# EAGLE design Scoreboard Wifi Controller 20170514 (EAGLE 7.6.0)
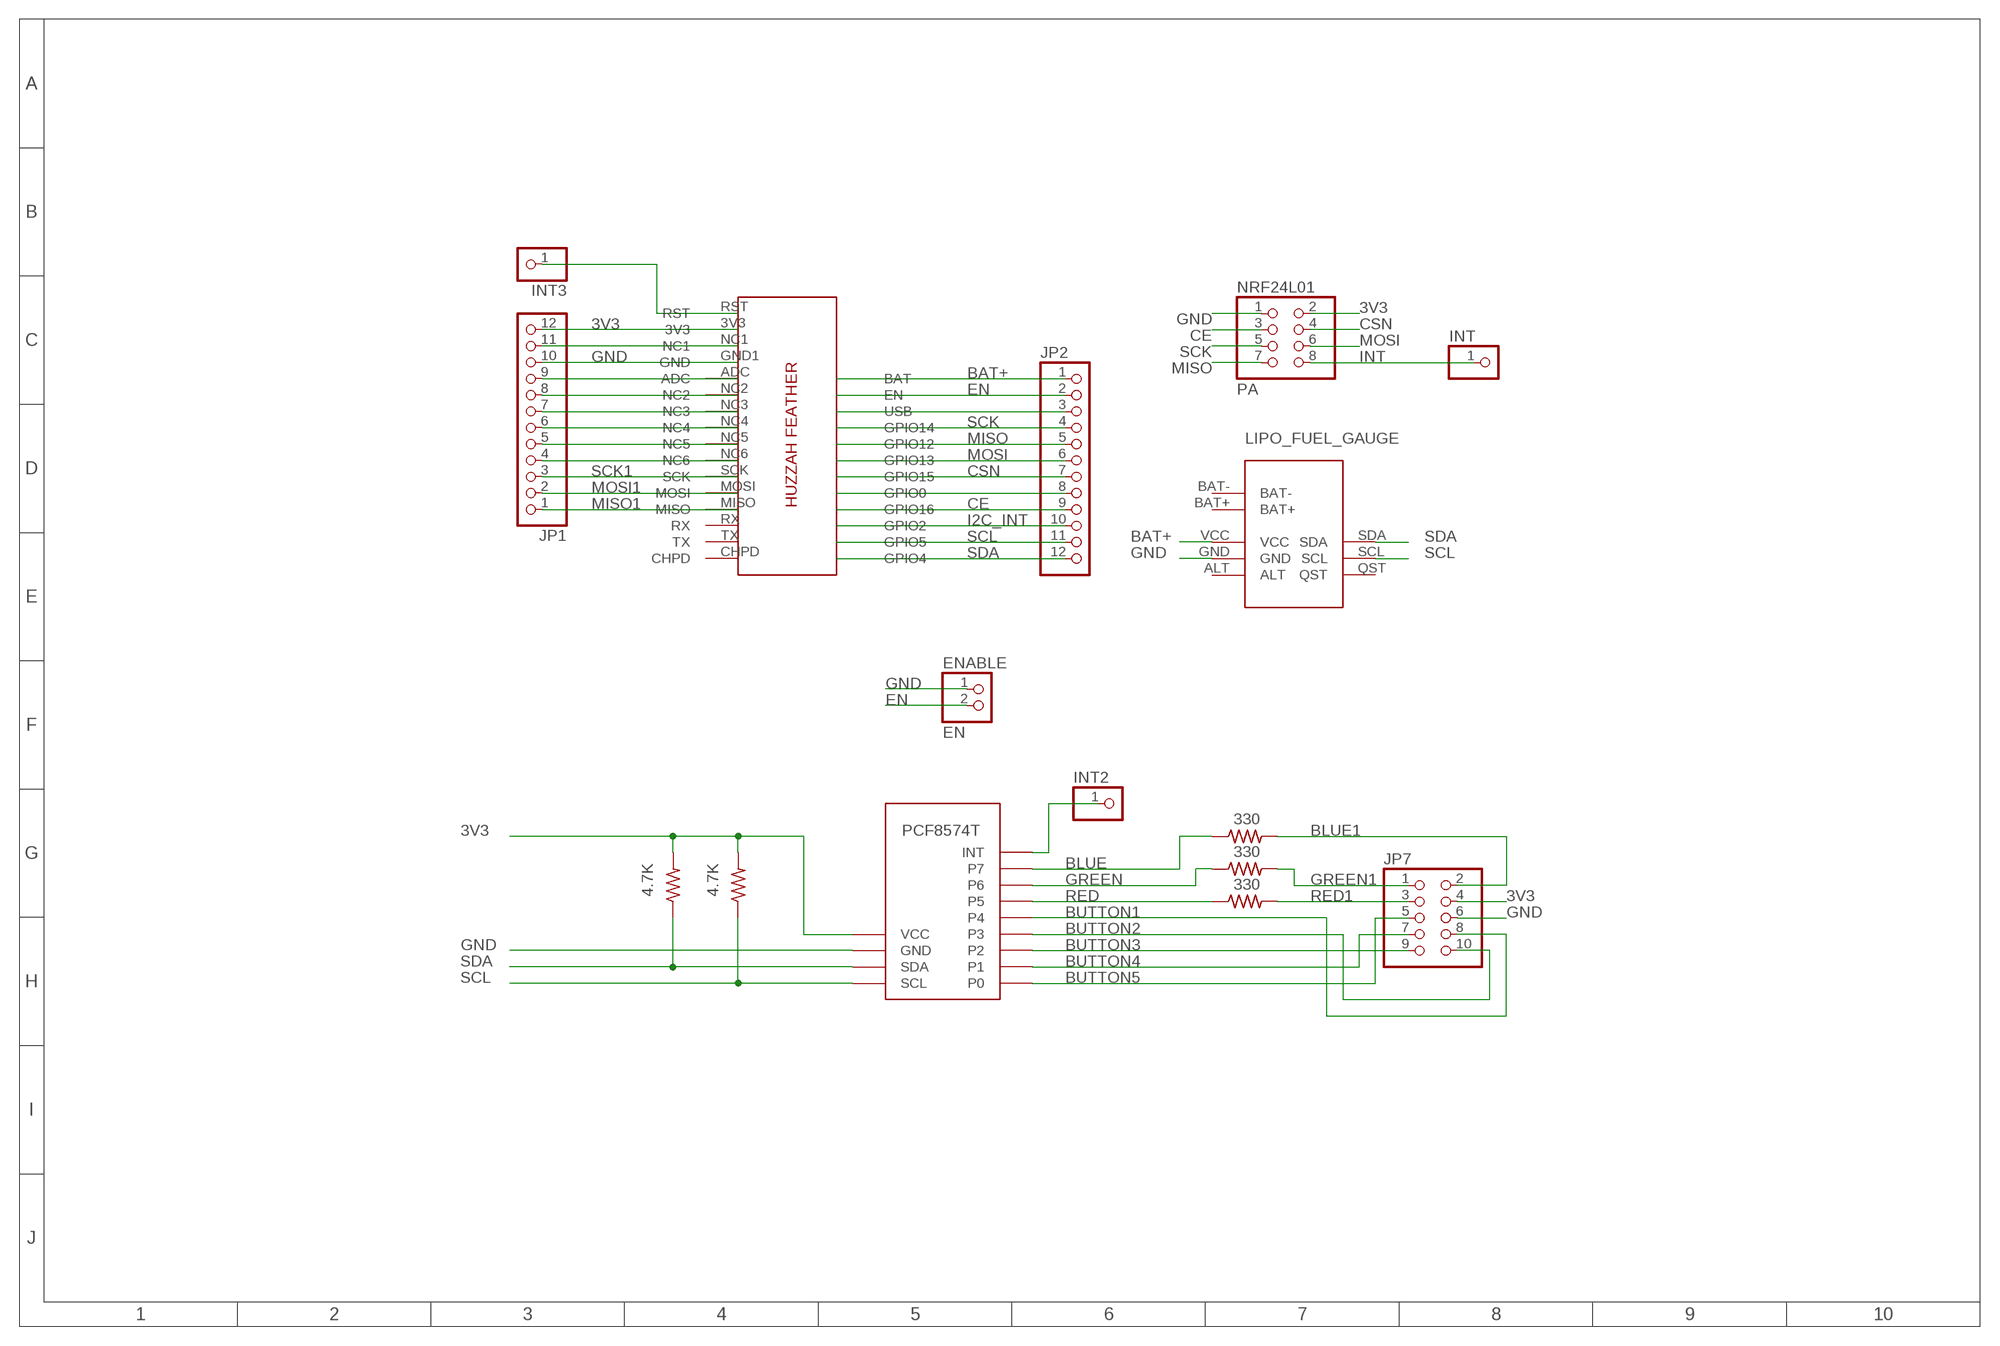
[diagram p0: schematic, sheet 1]

## Parts
ENABLE  EN  PINHD-1X2/90  [1X02/90]
INT  PINHD-1X1CB  [1X01-CLEANBIG]
INT2  PINHD-1X1CB  [1X01-CLEANBIG]
INT3  PINHD-1X1CB  [1X01-CLEANBIG]
JP1  PINHD-1X12-CB  [1X12-CB]
JP2  PINHD-1X12-CB  [1X12-CB]
JP7  PINHD-2X5/90  [2X05/90]
LIPO_FUEL_GAUGE  LIPO_FUEL_GAUGE  [LIPO_FUEL_GAUGE]
NRF24L01  PA  PINHD-2X4/90  [2X04/90]
R2  330  R-US_0207/10  [0207/10]
R3  330  R-US_0207/10  [0207/10]
R4  330  R-US_0207/10  [0207/10]
R5  4.7K  R-US_0207/10  [0207/10]
R6  4.7K  R-US_0207/10  [0207/10]
U$1  ADAFRUIT-FEATHER-ESP8266-HUZZAHALT  [ADAFRUIT-FEATHER-ESP8266-HUZZAH-ALT]
U$3  PCF8574T_IO_EXPANDER  [PCF8574T_IO_EXPANDER]

## Nets
3V3 [power]: JP1.12 JP7.4 NRF24L01.2 R5.2 R6.2 U$1.3V3 U$3.VCC
BAT+ [power]: JP2.1 LIPO_FUEL_GAUGE.VCC U$1.BAT
BLUE: R2.1 U$3.P$7(P7)
BLUE1: JP7.2 R2.2
BUTTON1: JP7.8 U$3.P$4(P4)
BUTTON2: JP7.10 U$3.P$3(P3)
BUTTON3: JP7.9 U$3.P$2(P2)
BUTTON4: JP7.7 U$3.P$1(P1)
BUTTON5: JP7.5 U$3.P$0(P0)
CE: JP2.9 NRF24L01.3 U$1.GPIO16
CSN: JP2.7 NRF24L01.4 U$1.GPIO15
EN: ENABLE.2 JP2.2 U$1.EN
GND [power]: ENABLE.1 JP1.10 JP7.6 LIPO_FUEL_GAUGE.GND NRF24L01.1 U$1.GND1(GND) U$3.GND
GREEN: R3.1 U$3.P$6(P6)
GREEN1: JP7.1 R3.2
I2C_INT: INT2.1 JP2.10 U$1.GPIO2 U$3.INT
INT: INT.1 NRF24L01.8
MISO: JP2.5 NRF24L01.7 U$1.GPIO12
MISO1: JP1.1 U$1.MISO
MOSI: JP2.6 NRF24L01.6 U$1.GPIO13
MOSI1: JP1.2 U$1.MOSI
N$39: JP1.9 U$1.ADC
N$63: JP2.8 U$1.GPIO0
N$64: JP2.3 U$1.USB
N$69: JP1.8 U$1.NC2
N$70: JP1.7 U$1.NC3
N$71: JP1.6 U$1.NC4
N$72: JP1.5 U$1.NC5
N$73: JP1.4 U$1.NC6
N$75: JP1.11 U$1.NC1
RED: R4.1 U$3.P$5(P5)
RED1: JP7.3 R4.2
RST: INT3.1 U$1.RST
SCK: JP2.4 NRF24L01.5 U$1.GPIO14
SCK1: JP1.3 U$1.SCK
SCL: JP2.11 LIPO_FUEL_GAUGE.SCL R5.1 U$1.GPIO5 U$3.SCL
SDA: JP2.12 LIPO_FUEL_GAUGE.SDA R6.1 U$1.GPIO4 U$3.SDA
Unconnected: LIPO_FUEL_GAUGE.ALT LIPO_FUEL_GAUGE.BAT+ LIPO_FUEL_GAUGE.BAT- LIPO_FUEL_GAUGE.QST U$1.CHPD U$1.RX U$1.TX

## Library data of the parts
ENABLE = pinhead:PINHD-1X2: PIN HEADER
INT INT2 INT3 = adafruit:PINHD-1X1: Pin header 1x1 for 0.1" spacing With round pins
JP1 JP2 = adafruit:PINHD-1X12: PIN HEADER
JP7 = pinhead:PINHD-2X5: PIN HEADER
LIPO_FUEL_GAUGE = Custom Parts:LIPO_FUEL_GAUGE
NRF24L01 = pinhead:PINHD-2X4: PIN HEADER
R2-R6 = adafruit:R-US_: RESISTOR, American symbol
U$1 = Custom Parts:ADAFRUIT-FEATHER-ESP8266-HUZZAH
U$3 = Custom Parts:PCF8574T_IO_EXPANDER

## Net classes
0 default: width 0.203 mm, clearance 0.203 mm
1 power: width 0.305 mm, clearance 0.203 mm
2 signal: width 0.203 mm, clearance 0.203 mm

## Board
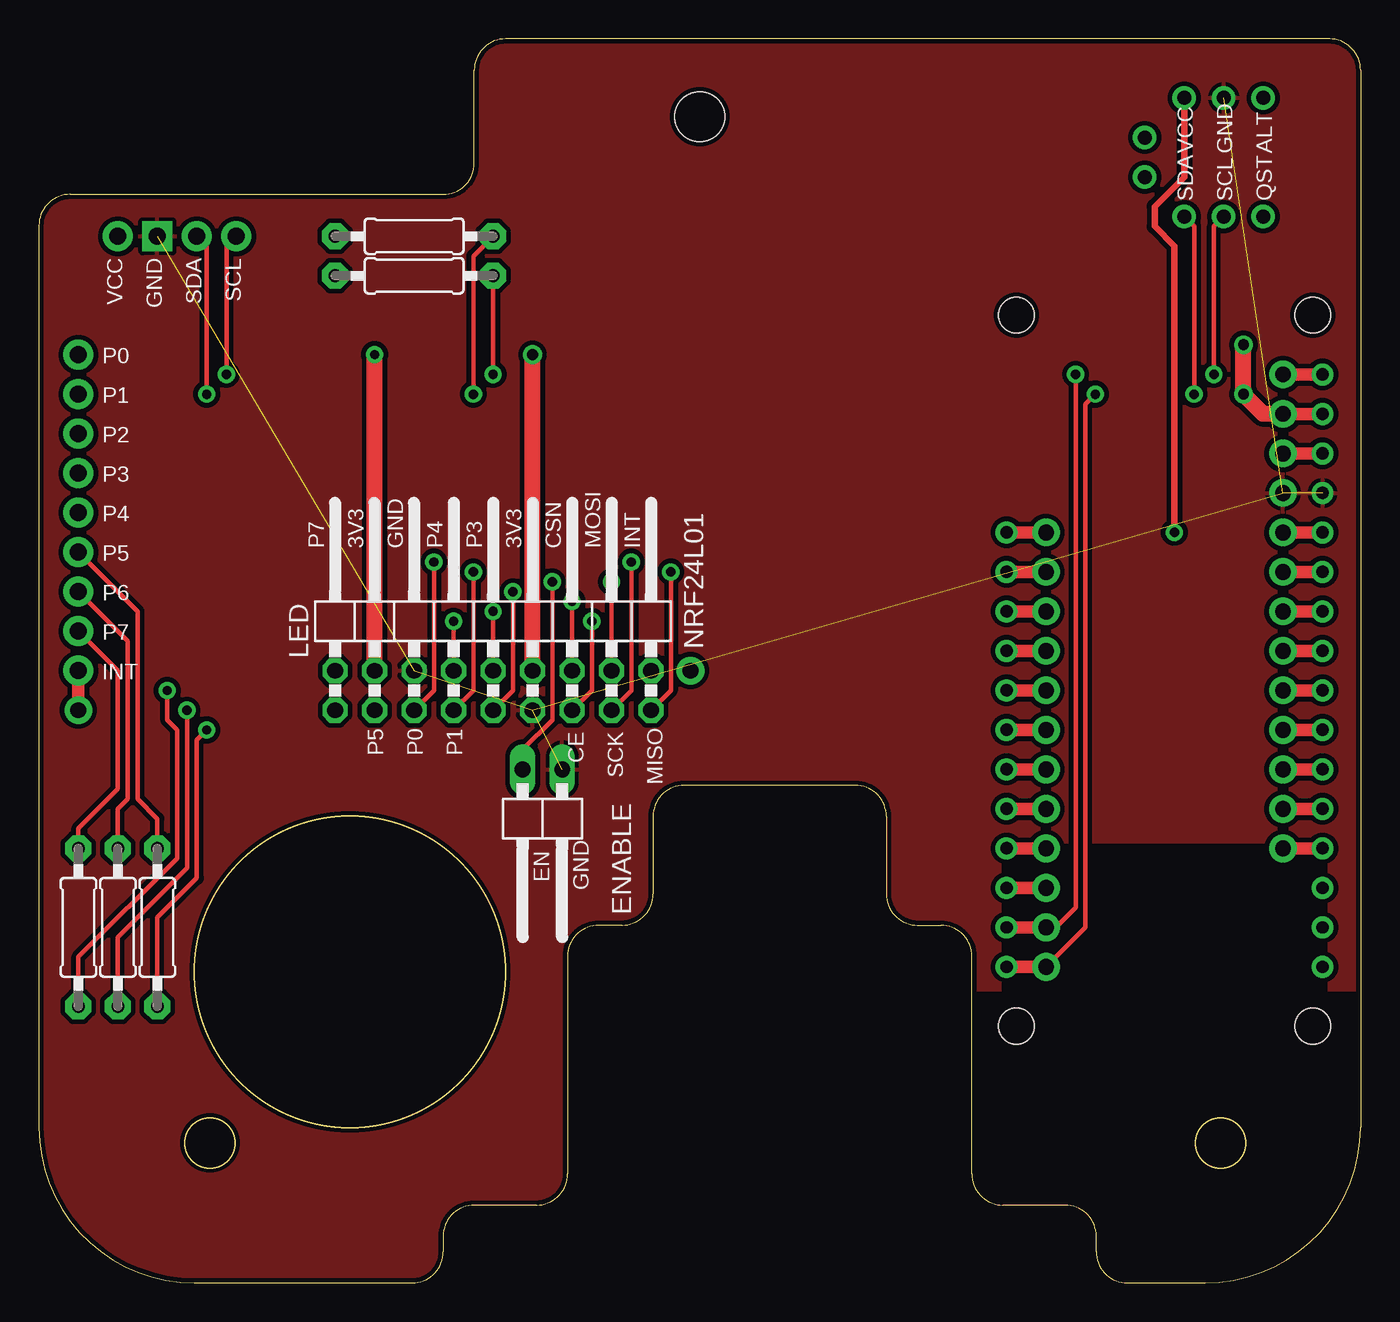
[diagram p1: board, top side]
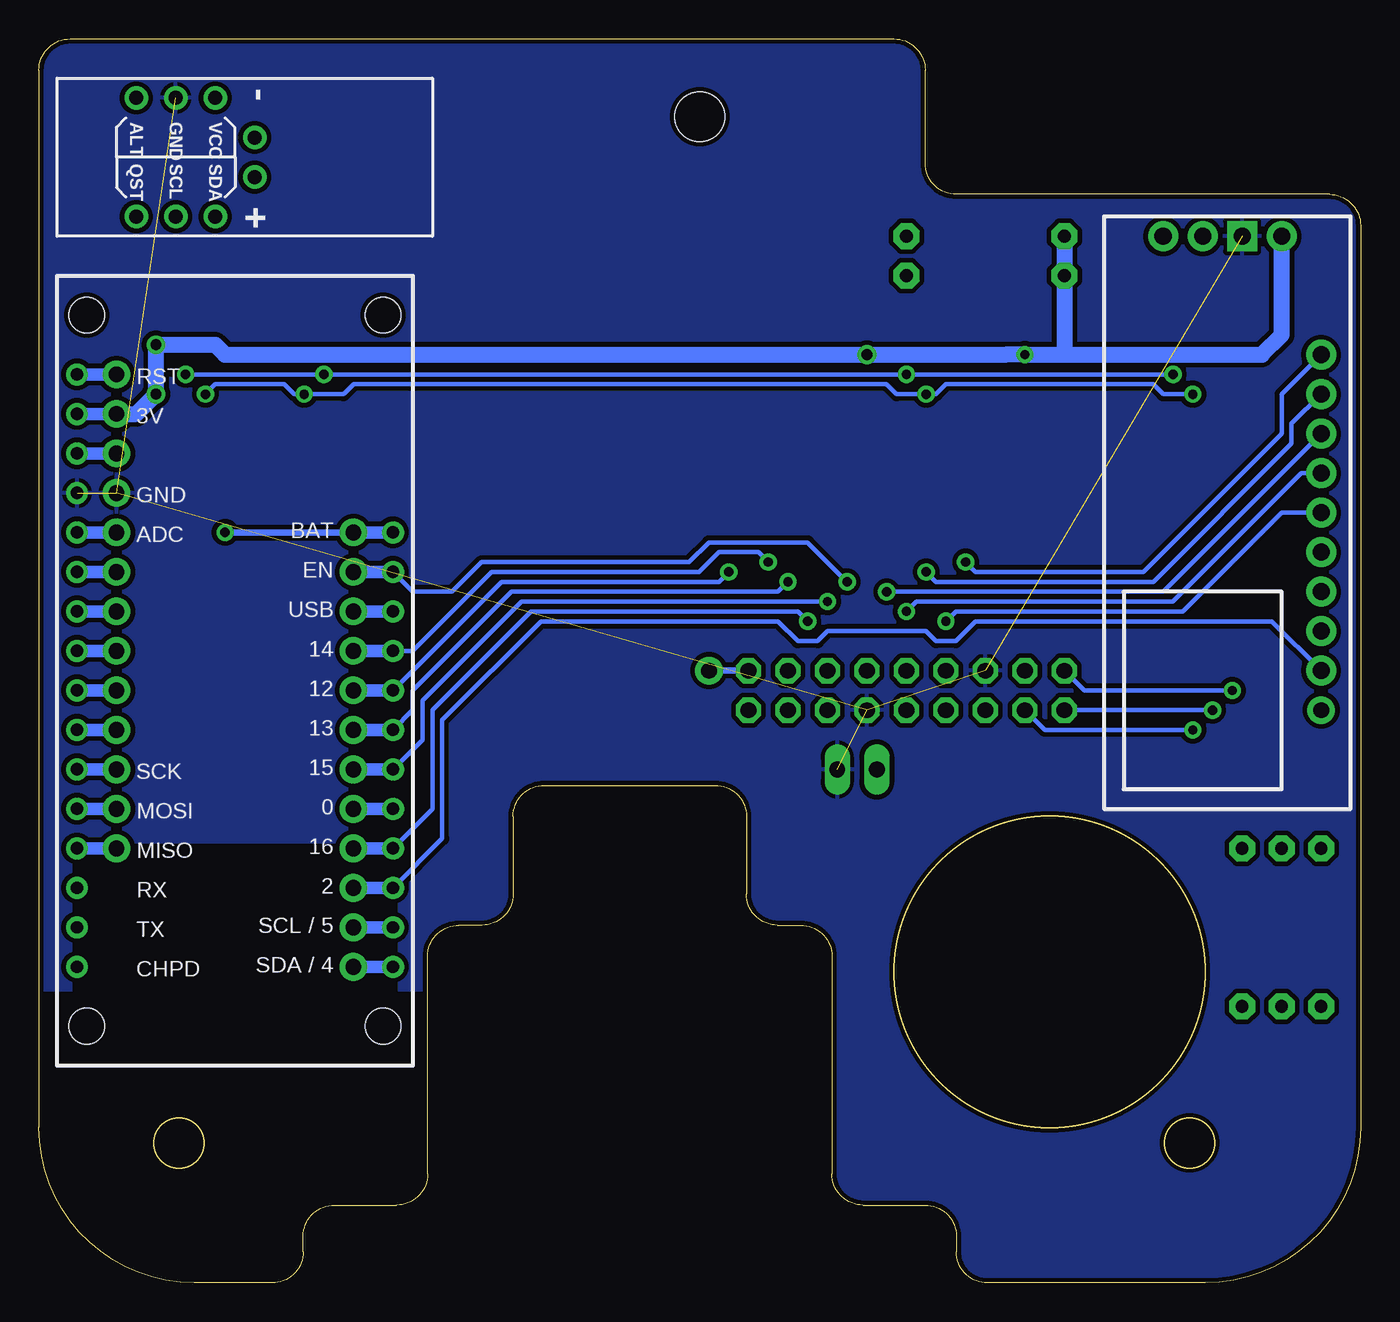
[diagram p2: board, bottom side, seen from below]

Size 85 x 80 mm. Coordinates in mm from the lower left corner, seen from the top.
Outline: 28,72 28,78 arc-90 30,80 83,80 arc-90 85,78 85,10 arc-90 75,0 70,0 arc-90 68,2 68,3 arc90 66,5 62,5 arc-90 60,7 60,21 arc90 58,23 56.5,23 arc-90 54.5,25 54.5,30 arc90 52.5,32 41.5,32 arc90 39.5,30 39.5,25 arc-90 37.5,23 36,23 arc90 34,21 34,7 arc-90 32,5 28,5 arc90 26,3 26,2 arc-90 24,0 10,0 arc-90 0,10 0,68 arc-90 2,70 26,70 arc90 28,72
Outline: circle at 11,9 radius 1.6
Outline: circle at 76,9 radius 1.6
Outline: circle at 20,20 radius 10
Copper layers (1*16): Top 0.035mm / dielectric 1.5mm / Bottom 0.035mm
Design rules "SparkFun": minimum track width 8mil, minimum drill 20mil, track to track 8mil, track to pad 8mil, pad to pad 8mil, via to via 8mil, smd to smd 8mil, copper to edge 10mil, drill to drill 8mil, minimum pad ring 12mil, minimum via ring 10mil, stop-mask expansion 4mil, vias tented up to drill 25mil, thermal gap 10mil
Holes 3.2 mm at 42.5,75 11,9 76,9
tRestrict: area 60.3,0 to 85.1,18.4; area 62.2,18.4 to 82.5,27.9
bRestrict: area 62.2,18.4 to 82.5,27.9; area 60.3,0 to 85.1,18.4

### Footprints (pad centres in the part's own frame; a part is rotated, then mirrored left to right if it is on the bottom)
1X02/90 = drill 1.016 long: 1 -1.27,-3.81; 2 1.27,-3.81
1X01-CLEANBIG = drill 1.016 pad 1.778: 1 0,0
1X12-CB = drill 1.016 pad 1.778: 1 -13.97,0; 2 -11.43,0; 3 -8.89,0; 4 -6.35,0; 5 -3.81,0; 6 -1.27,0; 7 1.27,0; 8 3.81,0; 9 6.35,0; 10 8.89,0; 11 11.43,0; 12 13.97,0
2X05/90 = drill 1.016 octagon: 1 -5.08,-6.35; 2 -5.08,-3.81; 3 -2.54,-6.35; 4 -2.54,-3.81; 5 0,-6.35; 6 0,-3.81; 7 2.54,-6.35; 8 2.54,-3.81; 9 5.08,-6.35; 10 5.08,-3.81
LIPO_FUEL_GAUGE = drill 0.9: ALT -3.81,-7.62; BAT+ 1.27,0; BAT- -1.27,0; GND -3.81,-5.08; QST 3.81,-7.62; SCL 3.81,-5.08; SDA 3.81,-2.54; VCC -3.81,-2.54
2X04/90 = drill 1.016 octagon: 1 -3.81,-6.35; 2 -3.81,-3.81; 3 -1.27,-6.35; 4 -1.27,-3.81; 5 1.27,-6.35; 6 1.27,-3.81; 7 3.81,-6.35; 8 3.81,-3.81
0207/10 = drill 0.813 pad 1.676 octagon: 1 -5.08,0; 2 5.08,0
ADAFRUIT-FEATHER-ESP8266-HUZZAH-ALT = drill 0.8: 3V3 -17.78,-10.16; ADC -10.16,-10.16; BAT -10.16,10.16; CHPD 17.78,-10.16; EN -7.62,10.16; GND1 -12.7,-10.16; GPIO0 7.62,10.16; GPIO2 12.7,10.16; GPIO4 17.78,10.16; GPIO5 15.24,10.16; GPIO12 0,10.16; GPIO13 2.54,10.16; GPIO14 -2.54,10.16; GPIO15 5.08,10.16; GPIO16 10.16,10.16; MISO 10.16,-10.16; MOSI 7.62,-10.16; NC1 -15.24,-10.16; NC2 -7.62,-10.16; NC3 -5.08,-10.16; NC4 -2.54,-10.16; NC5 0,-10.16; NC6 2.54,-10.16; RST -20.32,-10.16; RX 12.7,-10.16; SCK 5.08,-10.16; TX 15.24,-10.16; USB -5.08,10.16 | hole 2.286: -24.13,9.525; 21.59,9.525; 21.59,-9.525; -24.13,-9.525
PCF8574T_IO_EXPANDER = drill 1.1 pad 1.93 square: GND -17.78,0 | drill 1.1 pad 1.93: INT 10.16,5.08; P$0 -10.16,5.08; P$1 -7.62,5.08; P$2 -5.08,5.08; P$3 -2.54,5.08; P$4 0,5.08; P$5 2.54,5.08; P$6 5.08,5.08; P$7 7.62,5.08; SCL -17.78,-5.08; SDA -17.78,-2.54; VCC -17.78,2.54

### Placement (x,y rotation side)
ENABLE  32.38,29.21 180 top
INT  41.91,39.37 180 top
INT2  2.54,36.83 90 top
INT3  80.01,58.42 0 top
JP1  80.01,41.91 90 top
JP2  64.77,34.29 270 top
JP7  24.13,43.18 0 top
LIPO_FUEL_GAUGE  71.12,72.39 270 bottom
NRF24L01  35.56,43.18 0 top
R2  2.54,22.86 270 top
R3  5.08,22.86 270 top
R4  7.62,22.86 270 top
R5  24.13,64.77 180 top
R6  24.13,67.31 180 top
U$1  72.39,38.1 270 bottom
U$3  7.62,49.53 270 bottom

### Tracks (layer width: path | path; a pad name or v marks a point on that pad's centre or on a via)
3V3  (via drill 0.6, 0.7)
  Top 0.813: U$1.3V3 JP1.12
  Top 1.016: JP1.12 78.74,55.88 v77.47,57.15 v77.47,60.33 | NRF24L01.2 v31.75,59.69 | JP7.4 v21.59,59.69
  Bottom 0.813: JP1.12 U$1.3V3
  Bottom 1.016: JP1.12 78.74,55.88 v77.47,57.15 v77.47,60.33 73.66,60.33 73.03,59.69 v31.75,59.69 22.86,59.69 v21.59,59.69 19.05,59.69 | 19.05,59.69 6.35,59.69 5.08,60.96 U$3.VCC | R6.2 R5.2 19.05,59.69
BAT+  (via drill 0.6)
  Top 0.406: LIPO_FUEL_GAUGE.VCC 73.66,71.12 71.75,69.22 71.75,67.94 73.03,66.67 v73.03,48.26
  Top 0.813: U$1.BAT JP2.1
  Bottom 0.406: v73.03,48.26 JP2.1
  Bottom 0.813: U$1.BAT JP2.1
BLUE
  Top 0.305: R2.1 2.54,29.21 5.08,31.75 5.08,39.37 U$3.P$7
BLUE1  (via drill 0.6)
  Top 0.305: R2.2 2.54,20.95 8.89,27.3 8.89,35.56 8.26,36.2 v8.26,38.1
  Bottom 0.305: v8.26,38.1 17.78,38.1 JP7.2
BUTTON1  (via drill 0.6)
  Top 0.305: v26.67,42.55 JP7.8
  Bottom 0.305: v26.67,42.55 26.04,43.18 11.43,43.18 5.08,49.53 U$3.P$4
BUTTON2  (via drill 0.6)
  Top 0.305: v29.21,43.18 JP7.10
  Bottom 0.305: v29.21,43.18 28.57,43.81 12.06,43.81 3.81,52.07 U$3.P$3
BUTTON3  (via drill 0.6)
  Top 0.305: v30.48,44.45 30.48,38.1 JP7.9
  Bottom 0.305: v30.48,44.45 12.7,44.45 U$3.P$2
BUTTON4  (via drill 0.6)
  Top 0.305: v27.94,45.72 27.94,38.1 JP7.7
  Bottom 0.305: v27.94,45.72 27.3,45.09 13.34,45.09 4.45,53.98 4.45,55.24 U$3.P$1
BUTTON5  (via drill 0.6)
  Top 0.305: v25.4,46.35 25.4,38.1 JP7.5
  Bottom 0.305: v25.4,46.35 24.77,45.72 13.97,45.72 5.08,54.61 5.08,57.15 U$3.P$0
CE  (via drill 0.6)
  Top 0.305: v35.56,42.55 35.56,38.1 NRF24L01.3
  Top 0.813: U$1.GPIO16 JP2.9
  Bottom 0.305: U$1.GPIO16 59.69,30.48 59.69,36.83 53.34,43.18 36.2,43.18 v35.56,42.55
  Bottom 0.813: JP2.9 U$1.GPIO16
CSN  (via drill 0.6)
  Top 0.305: v34.29,43.81 NRF24L01.4
  Top 0.813: U$1.GPIO15 JP2.7
  Bottom 0.305: U$1.GPIO15 60.33,34.92 60.33,37.47 53.98,43.81 v34.29,43.81
  Bottom 0.813: JP2.7 U$1.GPIO15
EN  (via drill 0.6)
  Top 0.305: v33.02,45.09 33.02,36.2 31.11,34.29 ENABLE.2
  Top 0.813: U$1.EN JP2.2
  Bottom 0.305: v33.02,45.09 35.56,47.62 41.91,47.62 43.18,46.35 56.52,46.35 58.42,44.45 60.96,44.45 U$1.EN
  Bottom 0.813: U$1.EN JP2.2
GND  (6 unrouted)
  pour Bottom (isolate 0.305): 0,80 0,0 85,0 85,80
  pour Top (isolate 0.305): 0,0 0,80 85,80 85,0
GREEN
  Top 0.305: R3.1 5.08,30.48 5.71,31.11 5.71,41.27 U$3.P$6
GREEN1  (via drill 0.6)
  Top 0.305: R3.2 5.08,22.23 9.53,26.67 v9.53,36.83
  Bottom 0.305: v9.53,36.83 JP7.1
I2C_INT
  Top 0.813: U$1.GPIO2 JP2.10 | U$3.INT INT2.1
  Bottom 0.305: U$1.GPIO2 59.05,28.57 59.05,36.2 52.7,42.55 37.47,42.55 36.2,41.27 34.92,41.27 34.29,41.91 27.94,41.91 27.3,41.27 26.04,41.27 24.77,42.55 5.71,42.55 U$3.INT
  Bottom 0.813: JP2.10 U$1.GPIO2
INT
  Bottom 0.406: NRF24L01.8 INT.1
MISO  (via drill 0.6)
  Top 0.305: v40.64,45.72 40.64,38.1 NRF24L01.7
  Top 0.813: U$1.GPIO12 JP2.5
  Bottom 0.305: U$1.GPIO12 55.24,45.09 41.27,45.09 v40.64,45.72
  Bottom 0.813: JP2.5 U$1.GPIO12
MISO1
  Top 0.813: JP1.1 U$1.MISO
  Bottom 0.813: JP1.1 U$1.MISO
MOSI  (via drill 0.6)
  Top 0.305: v36.83,45.09 NRF24L01.6
  Top 0.813: U$1.GPIO13 JP2.6
  Bottom 0.305: U$1.GPIO13 60.96,36.83 60.96,38.1 54.61,44.45 37.47,44.45 v36.83,45.09
  Bottom 0.813: JP2.6 U$1.GPIO13
MOSI1
  Top 0.813: JP1.2 U$1.MOSI
  Bottom 0.813: JP1.2 U$1.MOSI
N$39
  Top 0.813: JP1.9 U$1.ADC
  Bottom 0.813: JP1.9 U$1.ADC
N$63
  Top 0.813: U$1.GPIO0 JP2.8
  Bottom 0.813: JP2.8 U$1.GPIO0
N$64
  Top 0.813: U$1.USB JP2.3
  Bottom 0.813: U$1.USB JP2.3
N$69
  Top 0.813: JP1.8 U$1.NC2
  Bottom 0.813: JP1.8 U$1.NC2
N$70
  Top 0.813: JP1.7 U$1.NC3
  Bottom 0.813: JP1.7 U$1.NC3
N$71
  Top 0.813: JP1.6 U$1.NC4
  Bottom 0.813: JP1.6 U$1.NC4
N$72
  Top 0.813: JP1.5 U$1.NC5
  Bottom 0.813: JP1.5 U$1.NC5
N$73
  Top 0.813: JP1.4 U$1.NC6
  Bottom 0.813: JP1.4 U$1.NC6
N$75
  Top 0.813: JP1.11 U$1.NC1
  Bottom 0.813: JP1.11 U$1.NC1
RED
  Top 0.305: R4.1 7.62,29.84 6.35,31.11 6.35,43.18 U$3.P$5
RED1  (via drill 0.6)
  Top 0.305: R4.2 7.62,23.5 10.16,26.04 10.16,34.92 v10.79,35.56
  Bottom 0.305: v10.79,35.56 20.32,35.56 JP7.3
RST
  Top 0.813: INT3.1 U$1.RST
  Bottom 0.813: INT3.1 U$1.RST
SCK  (via drill 0.6)
  Top 0.305: v38.1,46.35 38.1,38.1 NRF24L01.5
  Top 0.813: JP2.4 U$1.GPIO14
  Bottom 0.305: U$1.GPIO14 60.96,40.64 55.88,45.72 42.55,45.72 41.27,46.99 38.73,46.99 v38.1,46.35
  Bottom 0.813: JP2.4 U$1.GPIO14
SCK1
  Top 0.813: JP1.3 U$1.SCK
  Bottom 0.813: JP1.3 U$1.SCK
SCL  (via drill 0.6)
  Top 0.305: v75.56,58.42 75.56,67.94 LIPO_FUEL_GAUGE.SCL | R5.1 v29.21,58.42 | v12.06,58.42 12.06,66.67 U$3.SCL | JP2.11 65.41,22.86 66.67,24.13 v66.67,58.42
  Top 0.813: JP2.11 U$1.GPIO5
  Bottom 0.305: v12.06,58.42 v29.21,58.42 65.41,58.42 v66.67,58.42 v75.56,58.42
  Bottom 0.813: U$1.GPIO5 JP2.11
SDA  (via drill 0.6)
  Top 0.305: v74.3,57.15 74.3,67.94 LIPO_FUEL_GAUGE.SDA | v10.79,57.15 10.79,66.67 U$3.SDA | v27.94,57.15 27.94,66.04 R6.1 | JP2.12 67.31,22.86 67.31,56.52 v67.94,57.15
  Top 0.813: JP2.12 U$1.GPIO4
  Bottom 0.305: v74.3,57.15 73.66,57.78 69.22,57.78 68.58,57.15 v67.94,57.15 67.31,57.15 65.41,57.15 64.77,57.78 30.48,57.78 29.84,57.15 v27.94,57.15 27.3,57.15 26.67,57.78 13.34,57.78 12.7,57.15 v10.79,57.15
  Bottom 0.813: U$1.GPIO4 JP2.12

### Text on the board
tPlace: VCC | GND | ALT | SDA | SCL | QST | VCC | GND | SDA | SCL | P0 | P1 | P2 | P3 | P4 | P7 | 3V3 | GND | P4 | P3 | 3V3 | CSN | MOSI | INT | P5 | P6 | LED | P7 | INT | MISO | CE | SCK | P5 | P0 | P1 | EN | GND